# EAGLE design Adafruit TFT144 Breakout (EAGLE 6.3)
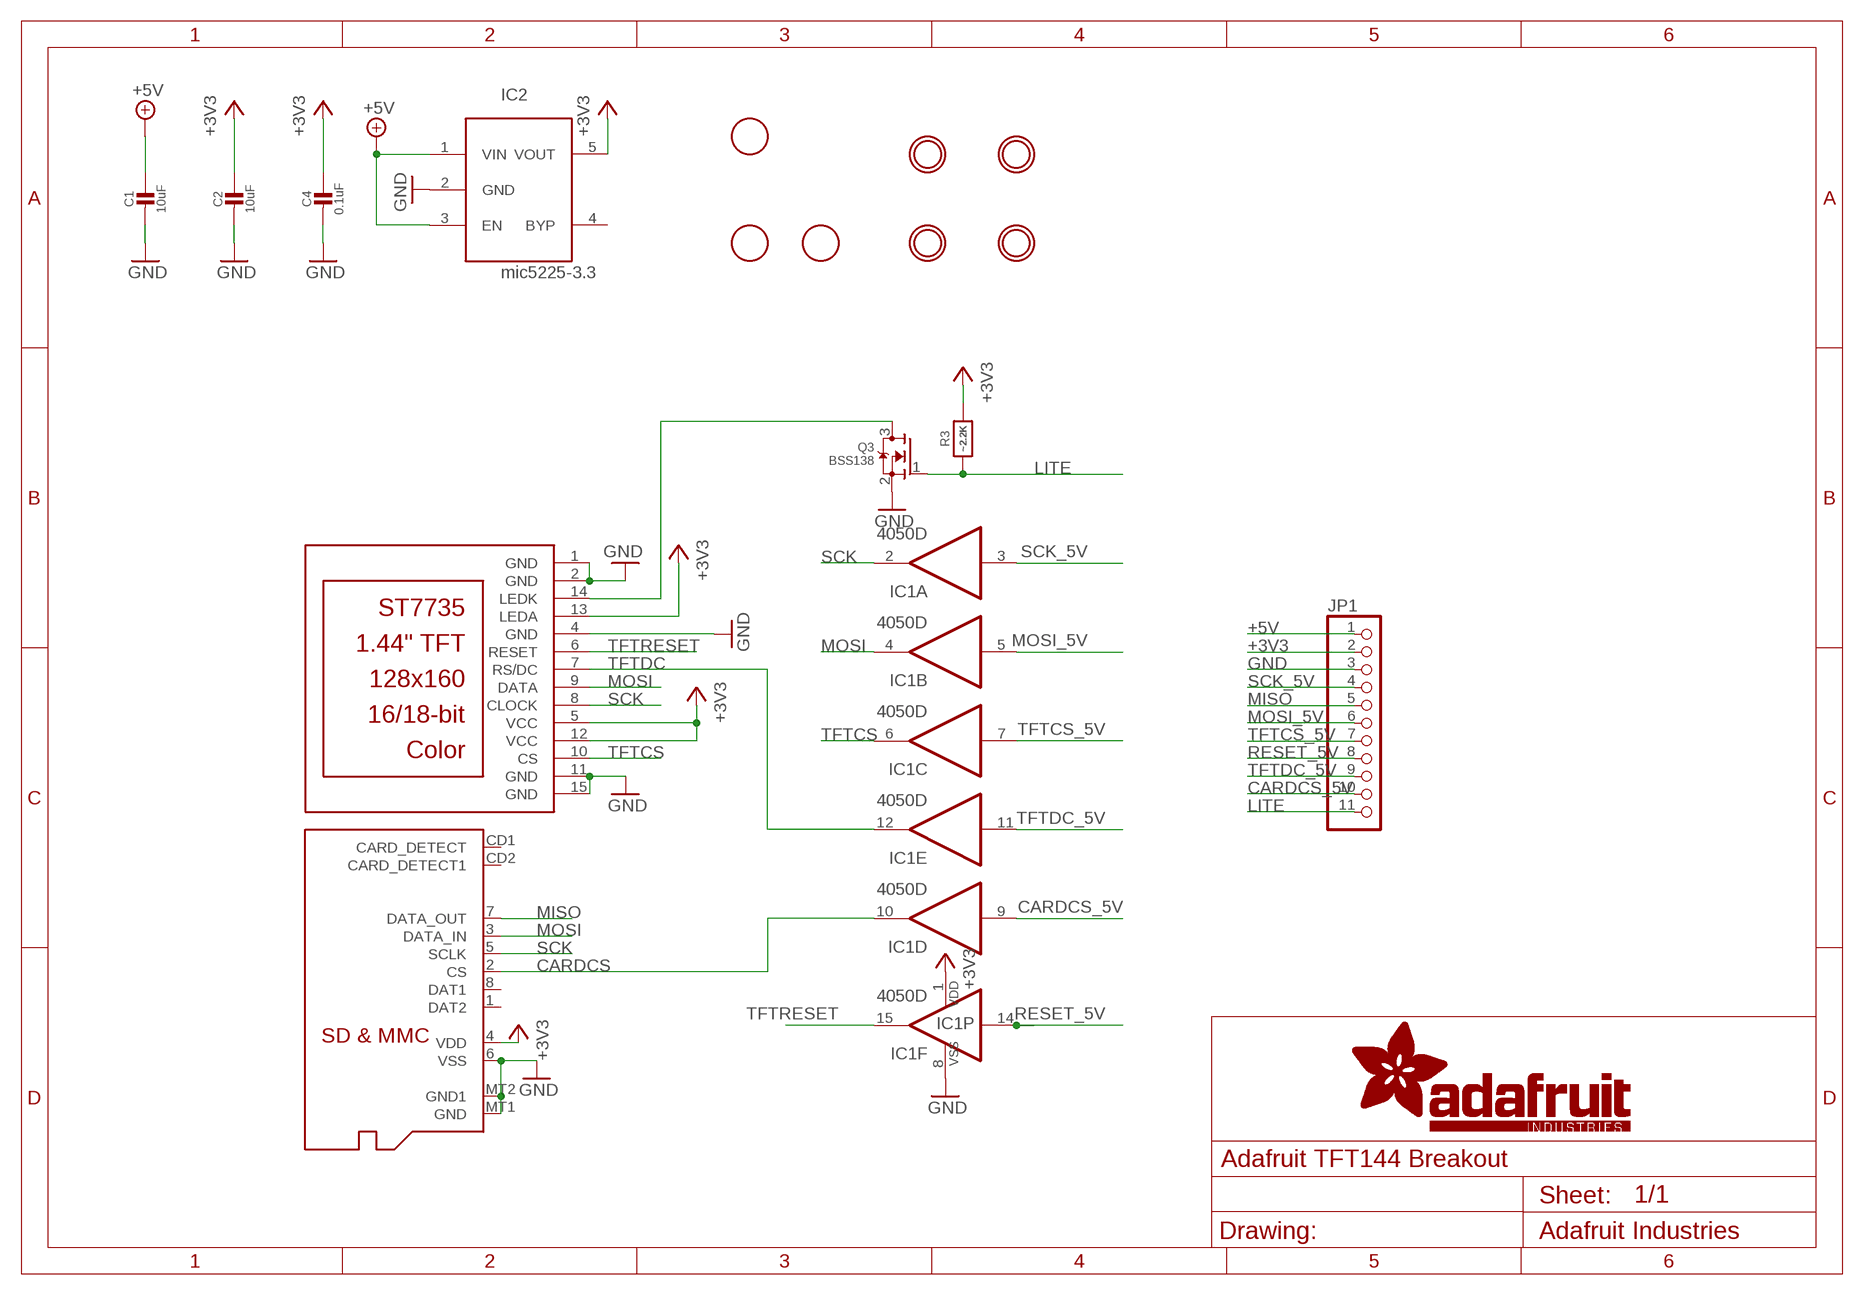
[diagram p0: schematic, sheet 1]

## Parts
C1  10uF  CAP_CERAMIC0805-NOOUTLINE  [0805-NO]
C2  10uF  CAP_CERAMIC0805-NOOUTLINE  [0805-NO]
C4  0.1uF  CAP_CERAMIC0805-NOOUTLINE  [0805-NO]
IC1  4050D  [SO16]
IC2  mic5225-3.3  LP298XS  [SOT23-5L]
JP1  HEADER-1X1176MIL  [1X11_ROUND_76]
Q2  MICROSD  [MICROSD]
Q3  BSS138  MOSFET-NWIDE  [SOT23-WIDE]
R3  ~2.2K  RESISTOR0805_NOOUTLINE  [0805-NO]
TFT2  DISP_LCD_FPC1441609  [TFT_FPC1441609]
U$3  FIDUCIAL  [FIDUCIAL_1MM]
U$4  FIDUCIAL  [FIDUCIAL_1MM]
U$5  FIDUCIAL  [FIDUCIAL_1MM]
U$7  MOUNTINGHOLE2.5  [MOUNTINGHOLE_2.5_PLATED]
U$8  MOUNTINGHOLE2.5  [MOUNTINGHOLE_2.5_PLATED]
U$9  MOUNTINGHOLE2.5  [MOUNTINGHOLE_2.5_PLATED]
U$10  MOUNTINGHOLE2.5  [MOUNTINGHOLE_2.5_PLATED]

## Nets
+3V3 [power]: C2.1 C4.1 IC1.1(P:VDD) IC2.5(VOUT) JP1.2 Q2.4(VDD) R3.2 TFT2.5(VCC) TFT2.12(VCC) TFT2.13(LEDA)
+5V [power]: C1.1 IC2.1(VIN) IC2.3(EN) JP1.1
CARDCS: IC1.10(D:O) Q2.2(CS)
CARDCS_5V: IC1.9(D:I) JP1.10
GND: C1.2 C2.2 C4.2 IC1.8(P:VSS) IC2.2(GND) JP1.3 Q2.6(VSS) Q2.MT1(GND) Q2.MT2(GND1) Q3.2(S) TFT2.1(GND) TFT2.2(GND) TFT2.4(GND) TFT2.11(GND) TFT2.15(GND)
LITE: JP1.11 Q3.1(G) R3.1
MISO: JP1.5 Q2.7(DATA_OUT)
MOSI: IC1.4(B:O) Q2.3(DATA_IN) TFT2.9(DATA)
MOSI_5V: IC1.5(B:I) JP1.6
N$5: Q3.3(D) TFT2.14(LEDK)
RESET_5V: IC1.14(F:I) JP1.8
SCK: IC1.2(A:O) Q2.5(SCLK) TFT2.8(CLOCK)
SCK_5V: IC1.3(A:I) JP1.4
TFTCS: IC1.6(C:O) TFT2.10(CS)
TFTCS_5V: IC1.7(C:I) JP1.7
TFTDC: IC1.12(E:O) TFT2.7(RS/DC)
TFTDC_5V: IC1.11(E:I) JP1.9
TFTRESET: IC1.15(F:O) TFT2.6(RESET)
Unconnected: IC2.4(BYP) Q2.1(DAT2) Q2.8(DAT1) Q2.CD1(CARD_DETECT) Q2.CD2(CARD_DETECT1)

## Library data of the parts
C1 C2 C4 = microbuilder:CAP_CERAMIC: Ceramic Capacitors For new designs, use the packages preceded by an '_' character since they are more reliable: The following footprints should be used on most boards: _0402 - Standard footprint for regular board layouts _0603 - Standard footprint for regular board layouts _0805 - Standard footprint for regular board layouts _1206 - Standard footprint for regular board layouts For extremely tight-pitch boards where space is at a premium, the following 'micro-pitch' footprints can be used (smaller pads, no silkscreen outline, etc.): _0402MP - Micro-pitch footprint for very dense/compact boards _0603MP - Micro-pitch footprint for very dense/compact boards _0805MP - Micro-pitch footprint for very dense/compact boards _1206MP - Micro-pitch footprint for very dense/compact boards
IC1 = 40xx:4050: Hex non-inverting BUFFER
IC2 = adafruit:LP298X
JP1 = microbuilder:HEADER-1X11
Q2 = adafruit:MICROSD: Micro-SD / Transflash card holder with SPI pinout For the 3M # 2908-05WB-MG and/or 4UCON #19656 push-push type
Q3 = microbuilder:MOSFET-N: N-Channel Mosfet LEGEND VDS: Voltage Drain-Source ID: Drain Current RDS(ON): Drain-Source On-State Resistance VGS(TH): Gate-Source Threshold Voltage CISS: Drain-Source Input Capacitance SOT-23 Name VDS ID RDS(ON) VGS(TH) CISS Order Number 2N7002E 60V 260mA 2.5 Ohm 2.5V @ 250uA 26.7pF @ 25V 2N7002ET1GOSTR-ND BSH103 30V 850mA 400 mOhm 400mV @ 1mA 83pF @ 24V BSH103,235-ND BSS138 60V 320mA 1.6 Ohm 1.5V @ 250uA 50pF @ 10V Mouser: 771-BSS138PW115 DMN2075U-7 20V 4.2A 38 mOhm 1V @ 250 uA 594.3pF @ 10V DMN2075U-7DICT-ND * BSS138 good choice for I2C level-shifting POWERPAK 1212-8 Name VDS ID RDS(ON) VGS(TH) CISS Order Number Si7308DN 60V 6A 58 mOhm 3V @ 250uA 665pF @ 15V SI7308DN-T1-E3CT-ND
R3 = microbuilder:RESISTOR: Resistors For new designs, use the packages preceded by an '_' character since they are more reliable: The following footprints should be used on most boards: _0402 - Standard footprint for regular board layouts _0603 - Standard footprint for regular board layouts _0805 - Standard footprint for regular board layouts _1206 - Standard footprint for regular board layouts For extremely tight-pitch boards where space is at a premium, the following 'micro-pitch' footprints can be used (smaller pads, no silkscreen outline, etc.): _0402MP - Micro-pitch footprint for very dense/compact boards _0603MP - Micro-pitch footprint for very dense/compact boards _0805MP - Micro-pitch footprint for very dense/compact boards _1206MP - Micro-pitch footprint for very dense/compact boards
TFT2 = microbuilder:DISP_LCD_FPC1441609
U$3-U$5 = adafruit:FIDUCIAL: For use by pick and place machines to calibrate the vision/machine, 1mm By microbuilder.eu
U$7-U$10 = microbuilder:MOUNTINGHOLE: Mounting Hole For #2 screws (0.086"/2.18mm width, 0.094"/2.4mm hole) use 2.5mm; BOM: EXCLUDE

## Net classes
1 power: width 0.406 mm

## Board
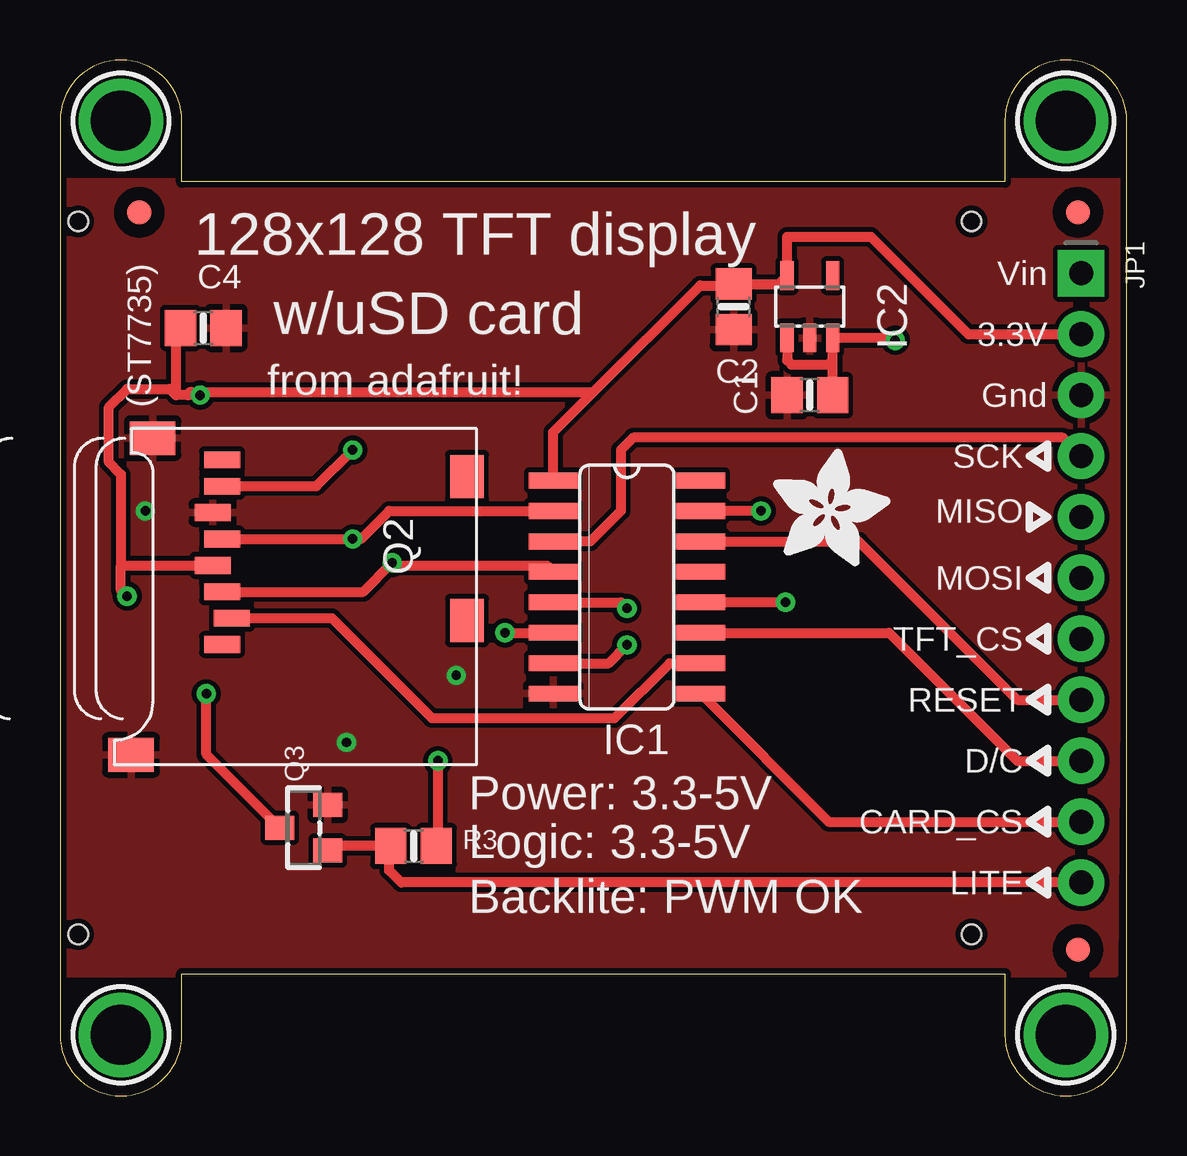
[diagram p1: board, top side]
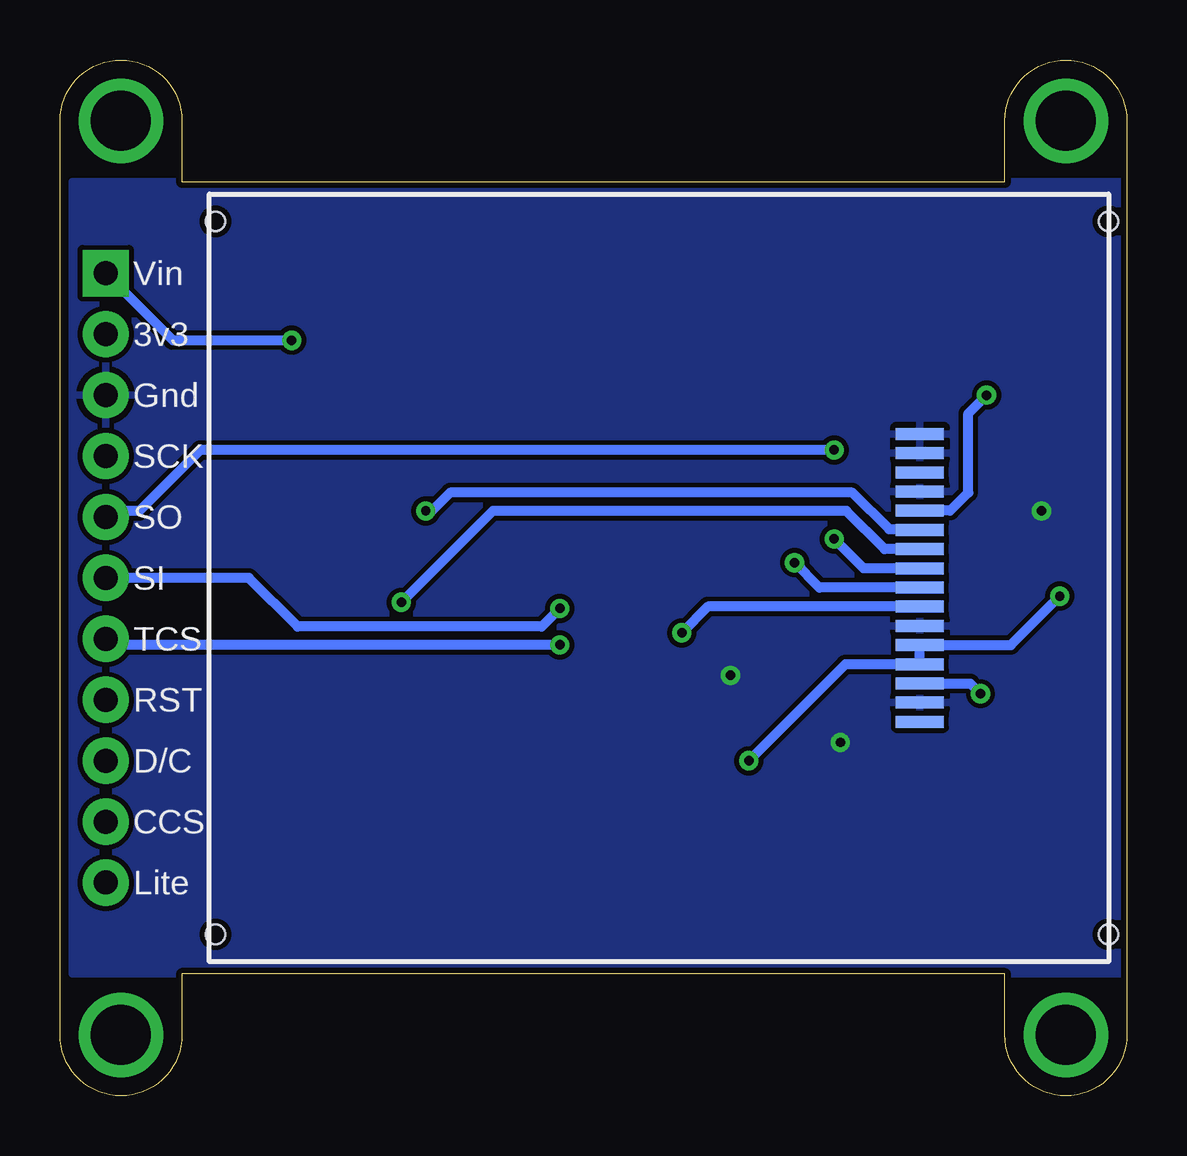
[diagram p2: board, bottom side, seen from below]

Size 44.45 x 43.18 mm. Coordinates in mm from the lower left corner, seen from the top.
Outline: 39.37,5.08 39.37,2.54 arc90 41.91,0 arc90 44.45,2.54 44.45,40.64 arc90 41.91,43.18 arc90 39.37,40.64 39.37,38.1 5.08,38.1 5.08,40.64 arc90 2.54,43.18 arc90 0,40.64 0,2.54 arc90 2.54,0 arc90 5.08,2.54 5.08,5.08 39.37,5.08
Copper layers (1*16): Top 0.035mm / dielectric 1.5mm / Bottom 0.035mm
Design rules "adafruit": minimum track width 8mil, minimum drill 15.5mil, track to track 8mil, track to pad 8mil, pad to pad 8mil, via to via 8mil, smd to smd 8mil, copper to edge 10mil, drill to drill 8mil, minimum pad ring 10mil, minimum via ring 8mil, stop-mask expansion 2mil, vias tented up to drill 20mil, thermal gap 10mil

### Footprints (pad centres in the part's own frame; a part is rotated, then mirrored left to right if it is on the bottom)
0805-NO = smd 1.3 x 1.5: 1 -0.95,0; 2 0.95,0
SO16 = smd 0.66 x 2.032: 1 -4.445,-3.073; 2 -3.175,-3.073; 3 -1.905,-3.073; 4 -0.635,-3.073; 5 0.635,-3.073; 6 1.905,-3.073; 7 3.175,-3.073; 8 4.445,-3.073; 9 4.445,3.073; 10 3.175,3.073; 11 1.905,3.073; 12 0.635,3.073; 13 -0.635,3.073; 14 -1.905,3.073; 15 -3.175,3.073; 16 -4.445,3.073
SOT23-5L = smd 0.55 x 1.2: 1 -0.95,-1.3; 2 0,-1.3; 3 0.95,-1.3; 4 0.95,1.3; 5 -0.95,1.3
1X11_ROUND_76 = drill 1 pad 1.93 square: 1 -12.7,0 | drill 1 pad 1.93: 2 -10.16,0; 3 -7.62,0; 4 -5.08,0; 5 -2.54,0; 6 0,0; 7 2.54,0; 8 5.08,0; 9 7.62,0; 10 10.16,0; 11 12.7,0
MICROSD = smd 0.7 x 1.5: 1 9,-10.64; 2 7.9,-10.24; 3 6.8,-10.64; 4 5.7,-11.04; 5 4.6,-10.64; 6 3.5,-11.04; 7 2.4,-10.64; 8 1.3,-10.64 | smd 1.8 x 1.4: CD1 2,-0.44; CD2 8,-0.44 | smd 1.4 x 1.9: MT1 0.4,-13.54; MT2 13.6,-14.44
SOT23-WIDE = smd 1 x 1.2: 1 -0.95,-1; 2 0.95,-1; 3 0,1
TFT_FPC1441609 = smd 0.5 x 2: 1 6,0.235; 2 5.2,0.235; 3 4.4,0.235; 4 3.6,0.235; 5 2.8,0.235; 6 2,0.235; 7 1.2,0.235; 8 0.4,0.235; 9 -0.4,0.235; 10 -1.2,0.235; 11 -2,0.235; 12 -2.8,0.235; 13 -3.6,0.235; 14 -4.4,0.235; 15 -5.2,0.235; 16 -6,0.235 | hole 0.8: -14.859,-7.62; 14.859,-7.62; -14.859,29.591; 14.859,29.591
FIDUCIAL_1MM = smd 1 x 1: 1 0,0
MOUNTINGHOLE_2.5_PLATED = drill 2.5 pad 3.2: P$1 0,0

### Placement (x,y rotation side)
C1  31.24,29.21 180 top
C2  28.07,32.89 270 top
C4  5.97,32 0 top
IC1  23.62,21.21 270 top
IC2  31.24,32.89 0 top
JP1  42.55,21.59 270 top
Q2  17.4,27.81 270 top
Q3  10.16,11.18 90 top
R3  14.73,10.41 0 top
TFT2  8.38,21.59 90 bottom
U$1  [ADAFRUIT_5MM]  29.72,22.1 0 top
U$3  42.42,6.1 0 top
U$4  3.3,36.83 0 top
U$5  42.42,36.83 0 top
U$7  2.54,40.64 0 top
U$8  2.54,2.54 0 top
U$9  41.91,40.64 0 top
U$10  41.91,2.54 0 top

### Tracks (layer width: path | path; a pad name or v marks a point on that pad's centre or on a via)
+3V3  (via drill 0.39)
  Top 0.406: IC1.1 20.55,27.66 22.23,29.34 | 22.23,29.34 26.67,33.78 28.01,33.78 C2.1 29.94,33.84 IC2.5 30.29,35.81 33.78,35.81 37.85,31.75 JP1.2 | C4.1 4.83,31.81 4.83,29.21 | 2.54,22.1 2.54,25.91 2.03,26.42 2.03,28.7 2.79,29.46 4.57,29.46 4.83,29.21 | 2.54,22.1 5.07,22.1 Q2.4 | v5.84,29.21 5.33,29.21 | 5.33,29.21 4.83,29.21 | 5.33,29.21 arc-90 5.46,29.34 22.23,29.34 | v15.75,13.97 15.75,10.48 R3.2 | v2.79,20.83 2.54,21.08 2.54,22.1
  Bottom 0.406: v5.84,29.21 6.6,28.45 6.6,25.15 7.36,24.39 TFT2.5 | v2.79,20.83 4.83,18.79 TFT2.12 TFT2.13 11.73,17.99 v15.75,13.97
+5V  (via drill 0.39)
  Top 0.406: IC2.1 30.29,30.67 30.48,30.48 32,30.48 32.19,30.67 | 32.19,30.67 IC2.3 34.7,31.59 v34.8,31.5 | C1.1 32.19,30.67
  Bottom 0.406: JP1.1 39.75,31.5 v34.8,31.5
CARDCS
  Top 0.406: Q2.2 11.33,19.91 15.49,15.75 23.11,15.75 25.4,18.03 IC1.10
CARDCS_5V
  Top 0.406: IC1.9 32.03,11.43 JP1.10
GND  (via drill 0.39)
  other vias: 16.51,17.53 11.94,14.73 3.56,24.38
  pour Top: -0.25,5.08 0,38.1 44.2,38.1 43.94,5.08
  pour Bottom: 43.94,5.08 0,5.08 0,38.1 43.94,38.1
LITE
  Top 0.406: JP1.11 14.22,8.89 13.72,9.4 13.72,10.35 R3.1 11.35,10.41 Q3.1
MISO  (via drill 0.39)
  Top 0.406: Q2.7 10.68,25.41 v12.19,26.92
  Bottom 0.406: v12.19,26.92 38.61,26.92 41.15,24.38 42.29,24.38 JP1.5
MOSI  (via drill 0.39)
  Top 0.406: Q2.3 12.63,21.01 v13.84,22.23 13.72,22.1 20.3,22.1 IC1.4
  Bottom 0.406: 13.57,21.99 v13.84,22.23 12.81,21.19 TFT2.9
MOSI_5V  (via drill 0.39)
  Top 0.406: IC1.5 23.37,20.57 v23.62,20.32
  Bottom 0.406: v23.62,20.32 24.38,19.56 34.54,19.56 36.58,21.59 JP1.6
N$5  (via drill 0.39)
  Top 0.406: Q3.3 6.1,14.24 v6.1,16.76
  Bottom 0.406: TFT2.14 6.52,17.19 v6.1,16.76
RESET_5V
  Top 0.406: IC1.14 33.27,23.11 39.88,16.51 JP1.8
SCK  (via drill 0.39)
  Top 0.406: Q2.5 v12.19,23.21 12.54,23.21 13.72,24.38 IC1.2
  Bottom 0.406: TFT2.8 10.97,21.99 v12.19,23.21
SCK_5V
  Top 0.406: JP1.4 41.78,27.43 23.88,27.43 23.37,26.92 23.37,24.38 22.1,23.11 IC1.3 19.81,23.11
TFTCS  (via drill 0.39)
  Top 0.406: v18.54,19.3 IC1.6
  Bottom 0.406: TFT2.10 17.46,20.39 v18.54,19.3
TFTCS_5V  (via drill 0.39)
  Top 0.406: IC1.7 22.86,18.03 v23.62,18.8
  Bottom 0.406: v23.62,18.8 42.29,18.8 JP1.7
TFTDC  (via drill 0.39)
  Top 0.406: v30.23,20.57 IC1.12
  Bottom 0.406: v30.23,20.57 26.42,24.38 11.68,24.38 10.09,22.79 TFT2.7
TFTDC_5V
  Top 0.406: IC1.11 34.54,19.3 39.88,13.97 JP1.9
TFTRESET  (via drill 0.39)
  Top 0.406: v29.21,24.38 IC1.15
  Bottom 0.406: v29.21,24.38 28.96,24.38 28.19,25.15 11.43,25.15 9.91,23.62 8.65,23.62 TFT2.6

### Text on the board
tPlace: 128x128 TFT display | Vin | w/uSD card | 3.3V | Gnd | (ST7735) | from adafruit! | SCK | MISO | MOSI | TFT_CS | RESET | D/C | Power: 3.3-5V | CARD_CS | Logic: 3.3-5V | LITE | Backlite: PWM OK
bPlace: Vin | 3v3 | Gnd | SCK | SO | SI | TCS | RST | D/C | CCS | Lite